# Altium schematic sheet Power.SchDoc
size A4; SheetNumber: 8; SheetTotal: 8
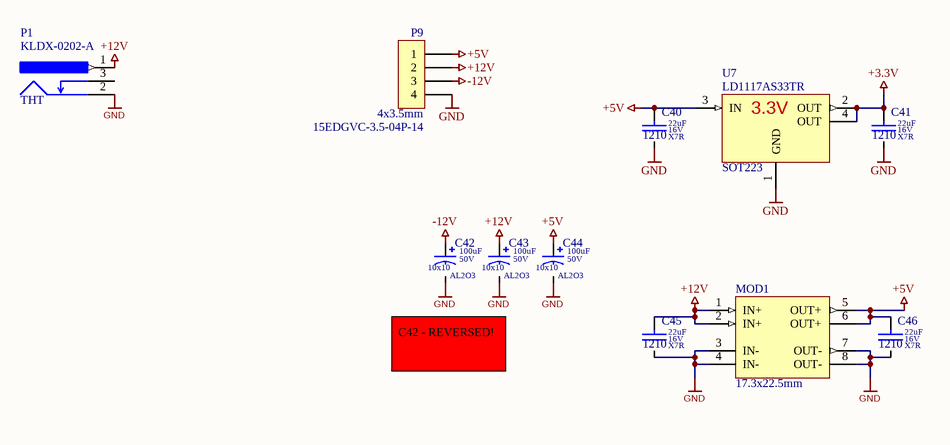
[diagram p0: Power.SchDoc]

## Parts
C40  value 22uF  Dielectric: X7R  Voltage: 16V  SCH_Footprint: 1210  [C_1210_3225]  (hidden comment: Ceramic X7R)
C41  value 22uF  Dielectric: X7R  Voltage: 16V  SCH_Footprint: 1210  [C_1210_3225]  (hidden comment: Ceramic X7R)
C42  value 100uF  Dielectric: AL2O3  SCH_Footprint: 10x10  Voltage: 50V  [CE_D_10x10_SMD]  (hidden comment: Electrolytic Capacitor)
C43  value 100uF  Dielectric: AL2O3  SCH_Footprint: 10x10  Voltage: 50V  [CE_D_10x10_SMD]  (hidden comment: Electrolytic Capacitor)
C44  value 100uF  Dielectric: AL2O3  SCH_Footprint: 10x10  Voltage: 50V  [CE_D_10x10_SMD]  (hidden comment: Electrolytic Capacitor)
C45  value 22uF  Dielectric: X7R  Voltage: 16V  SCH_Footprint: 1210  [C_1210_3225]  (hidden comment: Ceramic X7R)
C46  value 22uF  Dielectric: X7R  Voltage: 16V  SCH_Footprint: 1210  [C_1210_3225]  (hidden comment: Ceramic X7R)
MOD1  SCH_Footprint: 17.3x22.5mm  [MOD_BUCK_MP1584]  (hidden comment: Low cost, Aliexpress-ready DC-DC buck converter using MP1584)
P1  value KLDX-0202-A  SCH_Footprint: THT  [P_KLDX-0202-A]  (hidden comment: DC JACK)
P9  value 15EDGVC-3.5-04P-14  SCH_Footprint: 4x3.5mm  [P_15EDGVC-3.5-04P-14]  (hidden comment: 4-pin 3.5mm terminal block)
U7  SCH_Footprint: SOT223  [SOT223_SC73]  (hidden comment: LD1117AS33TR)

## Nets
+3.3V: C41.1 U7.2(OUT) U7.4(OUT)
+5V: C40.1 C44.1 C46.1 MOD1.5(OUT+) MOD1.6(OUT+) P9.1 U7.3(IN)
+12V: C43.1 C45.1 MOD1.1(IN+) MOD1.2(IN+) P1.1 P9.2
-12V: C42.1 P9.3
GND: C40.2 C41.2 C42.2 C43.2 C44.2 C45.2 C46.2 MOD1.3(IN-) MOD1.4(IN-) MOD1.7(OUT-) MOD1.8(OUT-) P1.2 P9.4 U7.1(GND)

Not connected (* = marked no-connect by the designer): P1 3

## Notes on the sheet
- C42 - REVERSED!

## Library data of the parts
C40 C41 C45 C46 = C_22uF_16V_X7R_1210_10_AECQ1: Capacitor; Manufacturer: Murata; Manufacturer Part Number: GCM32ER71C226KE19L; Tolerance (%): 10; AEC-Q: 1; Part Number: C_22uF_16V_X7R_1210_10_AECQ1; HelpURL: https://www.murata.com/products/productdetail?partno=GCM32ER71C226KE19%23; Supplier 1: TME; Supplier Part Number 1: GCM32ER71C226KE19L; Supplier 2: RS Components; Supplier 3: Farnell; Supplier Part Number 3: 3790409; Supplier 4: Mouser; Supplier Part Number 4: 81-GCM32ER71C226K19L; Supplier 5: Digi-Key; Supplier Part Number 5: 490-5242-1-ND; Supplier 6: LCSC; Supplier Part Number 6: C126614
C42-C44 = CE_100uF_50V_AL2O3_10x10_20: Polarized Capacitor; Manufacturer: Nichicon; Manufacturer Part Number: UUX1H101MNL1GS; Tolerance (%): 20; Part Number: CE_100uF_50V_AL2O3_10x10_20; HelpURL: https://datasheet.octopart.com/UUX1H101MNL1GS-Nichicon-datasheet-62047998.pdf; Supplier 1: TME; Supplier Part Number 1: UUX1H101MNL1GS; Supplier 2: RS Components; Supplier Part Number 2: 7393107; Supplier 3: Farnell; Supplier Part Number 3: 2841943; Supplier 4: Mouser; Supplier Part Number 4: 647-UUX1H101MNL1GS; Supplier 5: Digi-Key; Supplier Part Number 5: 493-6269-1-ND; Supplier 6: LCSC
MOD1 = MOD_BUCK_MP1584: Value: -; Part Number: MOD_BUCK_MP1584; HelpURL: https://pl.aliexpress.com/item/32341006065.html; Manufacturer: -; Manufacturer Part Number: -; Supplier 1: TME; Supplier 2: RS Components; Supplier 3: Farnell; Supplier 4: Mouser; Supplier 5: Digi-Key; Supplier 6: LCSC; Supplier 7: -; Supplier Part Number 7: -
P1 = P_KLDX-0202-A: Typical 3-pin jack power connector with switch; Manufacturer: Kycon; Part Number: P_KLDX-0202-A; HelpURL: http://www.kycon.com/2013Catalogpage/DC%20Power/KLDX_0202.pdf; Manufacturer Part Number: KLDX-0202-A; Supplier 1: TME; Supplier 2: RS Components; Supplier 3: Farnell; Supplier Part Number 3: 2839850; Supplier 4: Mouser; Supplier Part Number 4: 806-KLDX-0202-A; Supplier 5: Digi-Key; Supplier Part Number 5: 2092-KLDX-0202-A-ND; Supplier 6: LCSC
P9 = P_15EDGVC-3.5-04P-14: Pin Header; Manufacturer: DEGSON ELECTRONICS; Part Number: P_15EDGVC-3.5-04P-14; HelpURL: https://www.tme.eu/Document/83e7173fe653a2d0e44585e87978945b/opr014R8.pdf; Manufacturer Part Number: 15EDGVC-3.5-04P-14; Supplier 1: TME; Supplier Part Number 1: 15EDGVC-3.5-04P; Supplier 2: RS Components; Supplier 3: Farnell; Supplier 4: Mouser; Supplier 5: Digi-Key; Supplier 6: LCSC
U7 = VL_LD1117AS33TR_3V3_1A2: typical configuration; Manufacturer: STMicroelectronics; Voltage: 3.3V; Current: 1.2A; Value: LD1117AS33TR; Part Number: VL_LD1117AS33TR_3V3_1A2; HelpURL: http://www.tme.eu/pl/Document/bad00e7fc591b73ff810af309b2bb7a4/LD1117A.pdf; Manufacturer Part Number: LD1117AS33TR; Supplier 1: TME; Supplier Part Number 1: LD1117AS33; Supplier 2: RS Components; Supplier 3: Farnell; Supplier Part Number 3: 1467776; Supplier 4: Mouser; Supplier Part Number 4: LD1117AS33; Supplier 5: Digi-Key; Supplier Part Number 5: 497-1228-1-ND; Supplier 6: LCSC